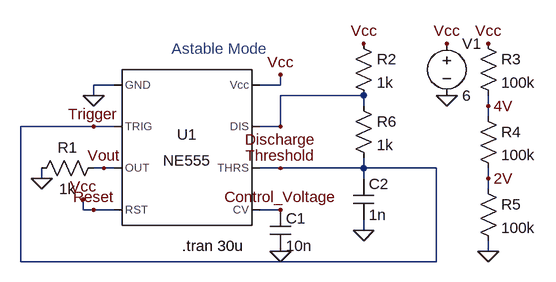
[diagram p0: schematic Astable.asc]
Astable.asc, the LTspice schematic file:
Version 4
SHEET 1 880 680
WIRE 64 80 32 80
WIRE 320 80 320 64
WIRE 320 80 288 80
WIRE 32 96 32 80
WIRE 448 96 320 96
WIRE 448 112 448 96
WIRE 640 112 640 96
WIRE 640 128 640 112
WIRE 32 144 -80 144
WIRE 64 144 32 144
WIRE 320 144 320 96
WIRE 320 144 288 144
WIRE 48 208 32 208
WIRE 64 208 48 208
WIRE 320 208 288 208
WIRE 448 208 448 192
WIRE 448 208 320 208
WIRE 560 208 448 208
WIRE -48 224 -48 208
WIRE 448 224 448 208
WIRE 640 224 640 208
WIRE 640 240 640 224
WIRE 16 272 16 256
WIRE 32 272 16 272
WIRE 64 272 32 272
WIRE 320 272 288 272
WIRE 448 304 448 288
WIRE 640 336 640 320
WIRE -80 352 -80 144
WIRE 560 352 560 208
WIRE 560 352 -80 352
FLAG 576 96 0
FLAG 576 16 Vcc
FLAG 320 64 Vcc
FLAG 32 96 0
FLAG -48 224 0
FLAG 320 336 0
FLAG 32 144 Trigger
FLAG 48 208 Vout
FLAG 32 272 Reset
FLAG 320 272 Control_Voltage
FLAG 320 208 Threshold
FLAG 320 144 Discharge
FLAG 640 336 0
FLAG 640 16 Vcc
FLAG 640 224 2V
FLAG 640 112 4V
FLAG 448 16 Vcc
FLAG 448 304 0
FLAG 16 256 Vcc
SYMBOL Misc\\NE555 176 176 R0
SYMATTR InstName U1
SYMBOL voltage 576 0 R0
WINDOW 123 0 0 Left 2
WINDOW 39 0 0 Left 2
SYMATTR InstName V1
SYMATTR Value 6
SYMBOL res 48 192 R90
WINDOW 0 0 56 VBottom 2
WINDOW 3 32 56 VTop 2
SYMATTR InstName R1
SYMATTR Value 1k
SYMBOL cap 304 272 R0
WINDOW 0 24 13 Left 2
SYMATTR InstName C1
SYMATTR Value 10n
SYMBOL res 624 0 R0
SYMATTR InstName R3
SYMATTR Value 100k
SYMBOL res 624 112 R0
SYMATTR InstName R4
SYMATTR Value 100k
SYMBOL res 624 224 R0
SYMATTR InstName R5
SYMATTR Value 100k
SYMBOL res 432 0 R0
SYMATTR InstName R2
SYMATTR Value 1k
SYMBOL res 432 96 R0
SYMATTR InstName R6
SYMATTR Value 1k
SYMBOL cap 432 224 R0
SYMATTR InstName C2
SYMATTR Value 1n
TEXT 168 328 Left 2 !.tran 30u
TEXT 152 24 Left 2 ;Astable Mode

The netlist it stands for:
* Astable.asc
XU1 0 Threshold Vout Reset Control_Voltage Threshold Discharge Reset NE555  ; pins GND TRIG OUT RST CV THRS DIS Vcc
V1 Reset 0 6
R1 Vout 0 1k
C1 Control_Voltage 0 10n
R3 Reset 4V 100k
R4 4V 2V 100k
R5 2V 0 100k
R2 Reset Discharge 1k
R6 Discharge Threshold 1k
C2 Threshold 0 1n
.tran 30u
* Astable Mode
.lib NE555.sub
.backanno
.end